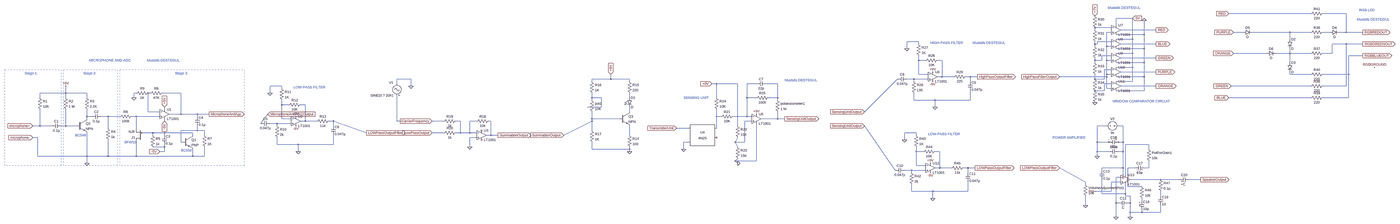
[diagram p0: schematic OVERALL CİRCUİT DİAGRAM.asc, whole sheet]
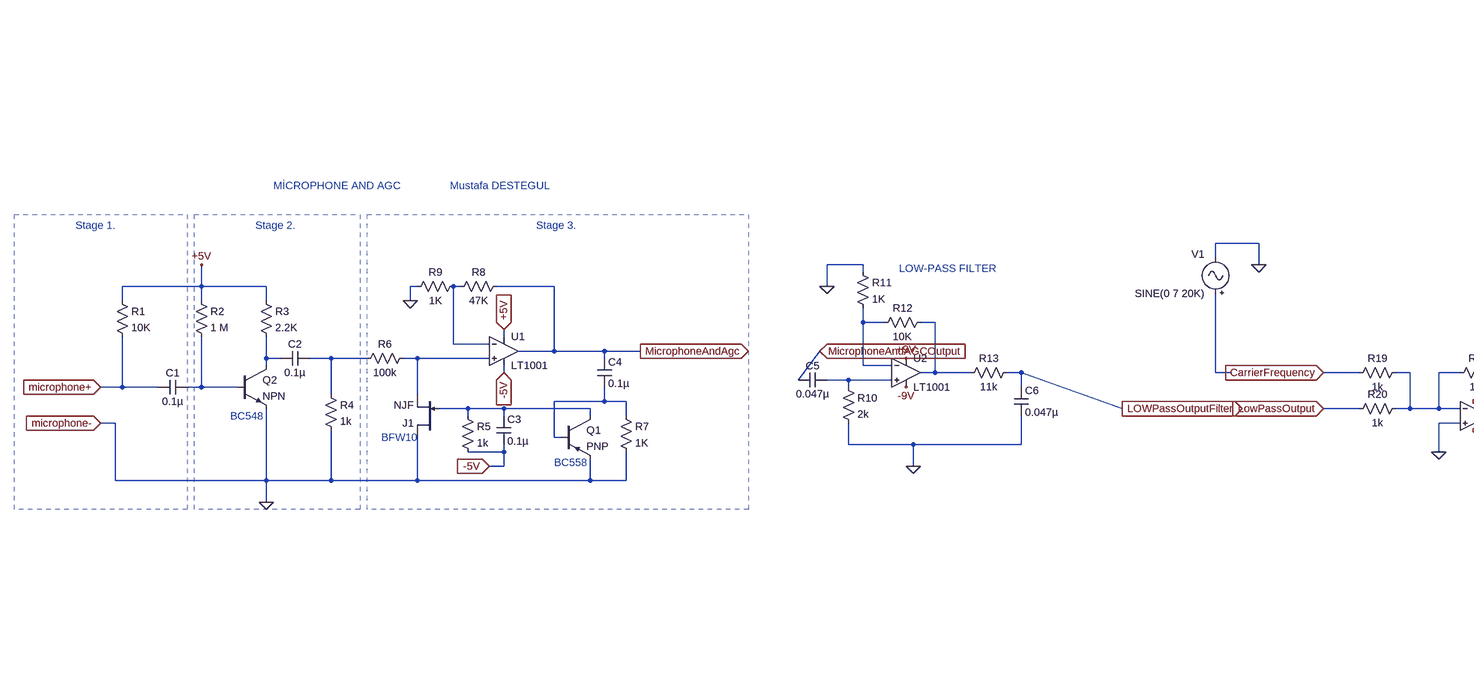
[diagram p1: schematic OVERALL CİRCUİT DİAGRAM.asc, part, row 1 of 1, column 1 of 3]
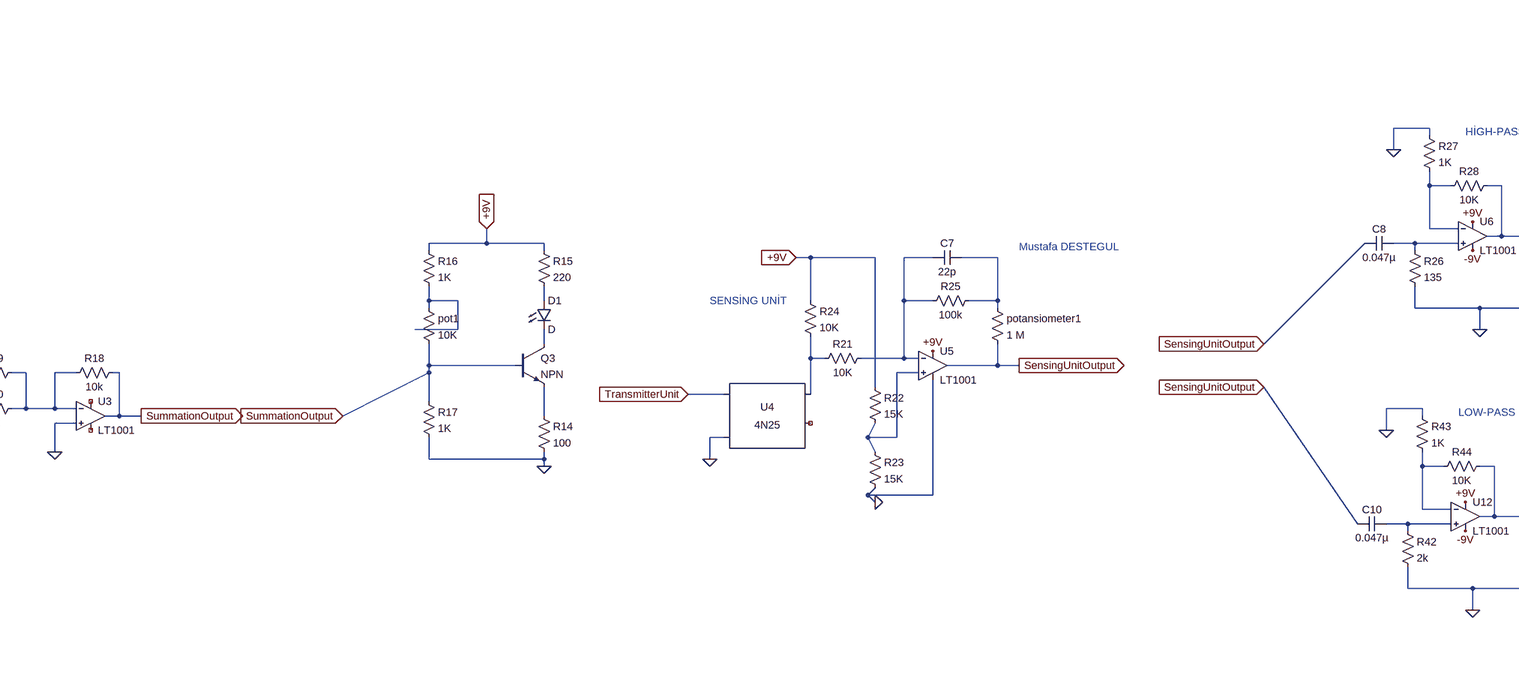
[diagram p2: schematic OVERALL CİRCUİT DİAGRAM.asc, part, row 1 of 1, column 2 of 3]
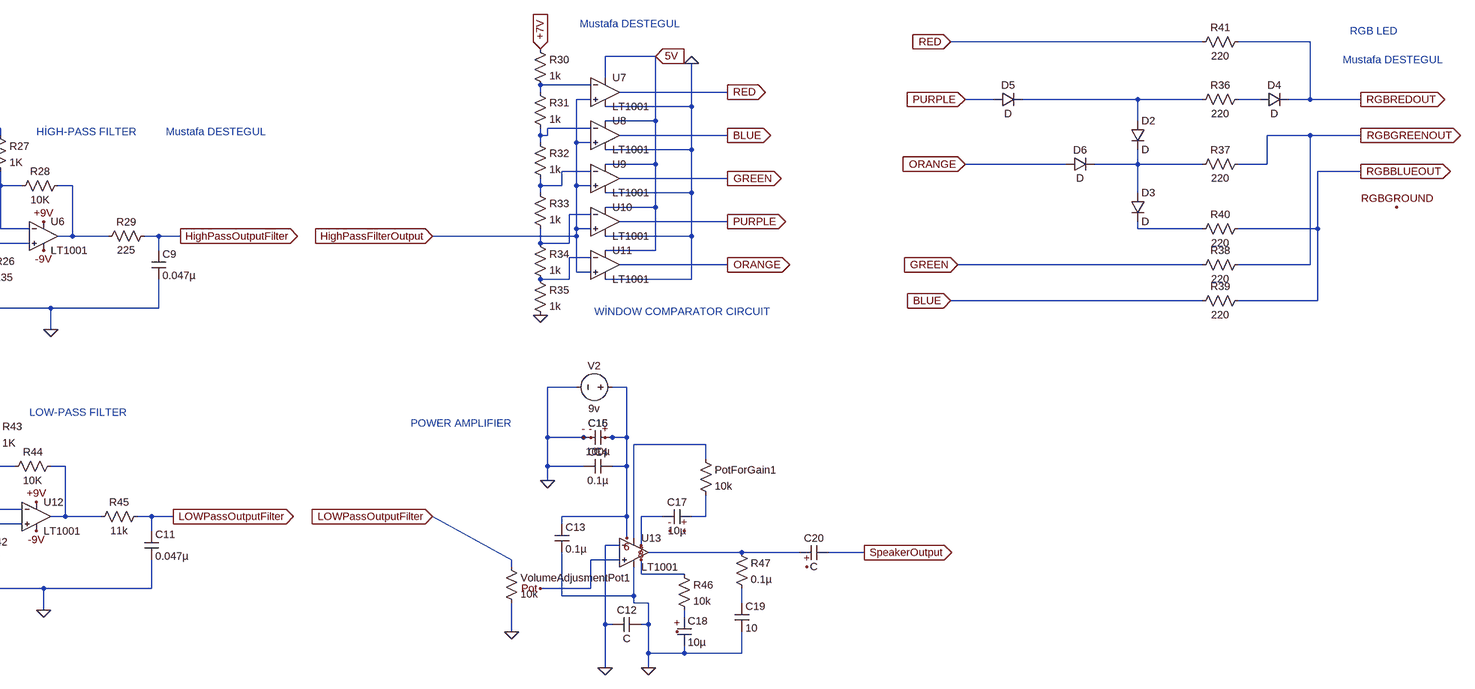
[diagram p3: schematic OVERALL CİRCUİT DİAGRAM.asc, part, row 1 of 1, column 3 of 3]
OVERALL CİRCUİT DİAGRAM.asc, the LTspice schematic file:
Version 4
SHEET 1 9064 680
WIRE 8464 -784 7888 -784
WIRE 8704 -784 8544 -784
WIRE 7232 -752 7120 -752
WIRE 7120 -704 7120 -752
WIRE 7088 -688 6976 -688
WIRE 6976 -672 6976 -688
WIRE 7392 -672 7152 -672
WIRE 7088 -656 7056 -656
WIRE 7984 -656 7920 -656
WIRE 8304 -656 8048 -656
WIRE 8464 -656 8304 -656
WIRE 8592 -656 8544 -656
WIRE 8704 -656 8704 -784
WIRE 8704 -656 8656 -656
WIRE 8816 -656 8704 -656
WIRE 7312 -640 7312 -736
WIRE 7312 -640 7120 -640
WIRE 7232 -608 7232 -752
WIRE 7232 -608 7120 -608
WIRE 8304 -608 8304 -656
WIRE 5776 -592 5696 -592
WIRE 7088 -592 6992 -592
WIRE 5776 -576 5776 -592
WIRE 6976 -576 6976 -592
WIRE 6992 -576 6992 -592
WIRE 6992 -576 6976 -576
WIRE 7392 -576 7152 -576
WIRE 8704 -576 8608 -576
WIRE 8816 -576 8704 -576
WIRE 6976 -560 6976 -576
WIRE 7056 -560 7056 -656
WIRE 7088 -560 7056 -560
WIRE 5696 -544 5696 -592
WIRE 7312 -544 7312 -640
WIRE 7312 -544 7120 -544
WIRE 7232 -512 7232 -608
WIRE 7232 -512 7120 -512
WIRE 8144 -512 7920 -512
WIRE 8304 -512 8304 -544
WIRE 8304 -512 8208 -512
WIRE 8464 -512 8304 -512
WIRE 8608 -512 8608 -576
WIRE 8608 -512 8544 -512
WIRE 7088 -496 7024 -496
WIRE 8816 -496 8720 -496
WIRE 7392 -480 7152 -480
WIRE 5776 -464 5776 -496
WIRE 5824 -464 5776 -464
WIRE 5936 -464 5904 -464
WIRE 6976 -464 6976 -480
WIRE 7024 -464 7024 -496
WIRE 7024 -464 6976 -464
WIRE 7056 -464 7056 -560
WIRE 7088 -464 7056 -464
WIRE 6976 -448 6976 -464
WIRE 7312 -448 7312 -544
WIRE 7312 -448 7120 -448
WIRE 8304 -448 8304 -512
WIRE 7232 -416 7232 -512
WIRE 7232 -416 7120 -416
WIRE 7088 -400 7040 -400
WIRE 7392 -384 7152 -384
WIRE 5776 -368 5776 -464
WIRE 5840 -368 5776 -368
WIRE 7056 -368 7056 -464
WIRE 7088 -368 7056 -368
WIRE 8304 -368 8304 -384
WIRE 8464 -368 8304 -368
WIRE 8720 -368 8720 -496
WIRE 8720 -368 8544 -368
WIRE 5936 -352 5936 -464
WIRE 5936 -352 5904 -352
WIRE 6016 -352 5936 -352
WIRE 6128 -352 6096 -352
WIRE 6176 -352 6128 -352
WIRE 7056 -352 7056 -368
WIRE 7056 -352 6736 -352
WIRE 7312 -352 7312 -448
WIRE 7312 -352 7120 -352
WIRE 2320 -336 2224 -336
WIRE 3680 -336 3680 -368
WIRE 3680 -336 3552 -336
WIRE 3808 -336 3680 -336
WIRE 5744 -336 5696 -336
WIRE 5840 -336 5744 -336
WIRE 6976 -336 6976 -368
WIRE 7040 -336 7040 -400
WIRE 7040 -336 6976 -336
WIRE 3552 -320 3552 -336
WIRE 3808 -320 3808 -336
WIRE 5744 -320 5744 -336
WIRE 6128 -320 6128 -352
WIRE 7232 -320 7232 -416
WIRE 7232 -320 7120 -320
WIRE 2224 -304 2224 -336
WIRE 4400 -304 4368 -304
WIRE 4544 -304 4400 -304
WIRE 4672 -304 4608 -304
WIRE 4816 -304 4736 -304
WIRE 7088 -304 7040 -304
WIRE 1440 -288 1360 -288
WIRE 2320 -288 2320 -336
WIRE 7392 -288 7152 -288
WIRE 8464 -288 7904 -288
WIRE 8704 -288 8704 -576
WIRE 8704 -288 8544 -288
WIRE 1440 -272 1440 -288
WIRE 7056 -272 7056 -352
WIRE 7088 -272 7056 -272
WIRE 7040 -256 7040 -304
WIRE 7040 -256 6976 -256
WIRE 7312 -256 7312 -352
WIRE 7312 -256 7120 -256
WIRE -192 -240 -192 -288
WIRE -192 -240 -368 -240
WIRE -48 -240 -192 -240
WIRE 288 -240 272 -240
WIRE 384 -240 368 -240
WIRE 592 -240 464 -240
WIRE 1360 -240 1360 -288
WIRE -368 -208 -368 -240
WIRE -192 -208 -192 -240
WIRE -48 -208 -48 -240
WIRE 272 -208 272 -240
WIRE 3552 -208 3552 -240
WIRE 3616 -208 3552 -208
WIRE 3808 -208 3808 -240
WIRE 4400 -208 4400 -304
WIRE 4608 -208 4608 -304
WIRE 4672 -208 4608 -208
WIRE 4816 -208 4816 -304
WIRE 4816 -208 4752 -208
WIRE 8464 -208 7888 -208
WIRE 8720 -208 8720 -368
WIRE 8720 -208 8544 -208
WIRE 3552 -192 3552 -208
WIRE 4816 -192 4816 -208
WIRE 5744 -192 5744 -240
WIRE 5888 -192 5744 -192
WIRE 6128 -192 6128 -256
WIRE 6128 -192 5888 -192
WIRE 1440 -160 1440 -192
WIRE 1488 -160 1440 -160
WIRE 1600 -160 1568 -160
WIRE 3616 -144 3616 -208
WIRE 3616 -144 3520 -144
WIRE 5888 -144 5888 -192
WIRE 480 -128 480 -144
WIRE 368 -112 368 -240
WIRE 448 -112 368 -112
WIRE 3808 -112 3808 -144
WIRE 5408 -112 5632 -336
WIRE 592 -96 592 -240
WIRE 592 -96 512 -96
WIRE 704 -96 592 -96
WIRE 784 -96 704 -96
WIRE -48 -80 -48 -128
WIRE -16 -80 -48 -80
WIRE 96 -80 48 -80
WIRE 176 -80 96 -80
WIRE 288 -80 256 -80
WIRE 448 -80 288 -80
WIRE 704 -80 704 -96
WIRE 4400 -80 4400 -128
WIRE 4432 -80 4400 -80
WIRE 4608 -80 4608 -208
WIRE 4608 -80 4512 -80
WIRE 4640 -80 4608 -80
WIRE -48 -64 -48 -80
WIRE 1440 -64 1440 -160
WIRE 1504 -64 1440 -64
WIRE 3552 -64 3552 -112
WIRE 3744 -64 3552 -64
WIRE 4816 -64 4816 -112
WIRE 4816 -64 4704 -64
WIRE 4864 -64 4816 -64
WIRE 480 -48 480 -64
WIRE 1600 -48 1600 -160
WIRE 1600 -48 1568 -48
WIRE 1680 -48 1600 -48
WIRE 1792 -48 1760 -48
WIRE 2224 -48 2224 -224
WIRE 2256 -48 2224 -48
WIRE 2544 -48 2464 -48
WIRE 2656 -48 2624 -48
WIRE 2768 -48 2720 -48
WIRE 2864 -48 2848 -48
WIRE 3552 -48 3552 -64
WIRE 4640 -48 4592 -48
WIRE 1296 -32 1344 -96
WIRE 1408 -32 1360 -32
WIRE 1504 -32 1408 -32
WIRE -368 -16 -368 -128
WIRE -368 -16 -416 -16
WIRE -288 -16 -368 -16
WIRE -192 -16 -192 -128
WIRE -192 -16 -224 -16
WIRE -112 -16 -192 -16
WIRE 1408 -16 1408 -32
WIRE 1792 -16 1792 -48
WIRE 4544 -16 4544 -304
WIRE 7056 -16 6992 -16
WIRE 7168 -16 7136 -16
WIRE 96 0 96 -80
WIRE 288 0 288 -80
WIRE 4208 0 4128 0
WIRE 4400 0 4400 -80
WIRE 704 16 704 -16
WIRE 704 16 592 16
WIRE 752 16 704 16
WIRE 3552 16 3552 -48
WIRE 400 32 336 32
WIRE 480 32 400 32
WIRE 672 32 480 32
WIRE 2016 32 1792 -48
WIRE 2544 32 2464 32
WIRE 2656 32 2656 -48
WIRE 2656 32 2624 32
WIRE 2720 32 2720 -48
WIRE 2720 32 2656 32
WIRE 2768 32 2720 32
WIRE 5760 32 5680 32
WIRE 400 48 400 32
WIRE 480 48 480 32
WIRE 672 48 672 32
WIRE 752 48 752 16
WIRE 2864 48 2864 -48
WIRE 2864 48 2832 48
WIRE 2912 48 2864 48
WIRE 3360 48 3552 -48
WIRE 3808 48 3808 -16
WIRE 5760 48 5760 32
WIRE -384 64 -416 64
WIRE 2768 64 2720 64
WIRE 5680 80 5680 32
WIRE 592 96 592 16
WIRE 608 96 592 96
WIRE 4208 96 4176 96
WIRE 4528 96 4544 64
WIRE 4592 96 4592 -48
WIRE 4592 96 4528 96
WIRE 6992 96 6992 -16
WIRE 7072 96 6992 96
WIRE 7168 96 7168 -16
WIRE 7168 96 7136 96
WIRE 1408 112 1408 64
WIRE 1552 112 1408 112
WIRE 1792 112 1792 48
WIRE 1792 112 1552 112
WIRE 7344 112 7184 112
WIRE 480 128 480 112
WIRE 480 128 400 128
WIRE 2720 128 2720 64
WIRE 4544 128 4528 96
WIRE 3552 144 3552 96
WIRE 3808 144 3808 128
WIRE 3808 144 3552 144
WIRE 4176 144 4176 96
WIRE 7344 144 7344 112
WIRE 480 160 480 128
WIRE 480 160 448 160
WIRE 1552 160 1552 112
WIRE 3808 160 3808 144
WIRE 5760 160 5760 128
WIRE 5808 160 5760 160
WIRE 5920 160 5888 160
WIRE 6992 160 6992 96
WIRE 7072 160 6992 160
WIRE 7168 160 7168 96
WIRE 7168 160 7136 160
WIRE -384 192 -384 64
WIRE -48 192 -48 32
WIRE -48 192 -384 192
WIRE 96 192 96 80
WIRE 96 192 -48 192
WIRE 288 192 288 96
WIRE 288 192 96 192
WIRE 672 192 672 144
WIRE 672 192 288 192
WIRE 752 192 752 128
WIRE 752 192 672 192
WIRE 6992 192 6992 160
WIRE 4528 224 4544 208
WIRE 4672 224 4672 -32
WIRE 4672 224 4528 224
WIRE -48 240 -48 192
WIRE 4544 240 4528 224
WIRE 5760 256 5760 160
WIRE 5824 256 5760 256
WIRE 5920 272 5920 160
WIRE 5920 272 5888 272
WIRE 6000 272 5920 272
WIRE 6112 272 6080 272
WIRE 6160 272 6112 272
WIRE 7168 272 7168 160
WIRE 7168 272 7024 272
WIRE 7248 272 7200 272
WIRE 7344 272 7344 224
WIRE 7344 272 7312 272
WIRE 5616 288 5408 -16
WIRE 5728 288 5680 288
WIRE 5824 288 5728 288
WIRE 7024 288 7024 272
WIRE 5728 304 5728 288
WIRE 6112 304 6112 272
WIRE 7168 320 7168 272
WIRE 7184 320 7184 112
WIRE 7152 336 7120 336
WIRE 7200 336 7200 272
WIRE 7424 352 7216 352
WIRE 7552 352 7424 352
WIRE 7696 352 7616 352
WIRE 6912 368 6736 272
WIRE 7152 368 7088 368
WIRE 6912 384 6912 368
WIRE 7200 400 7200 368
WIRE 7296 400 7200 400
WIRE 5728 432 5728 384
WIRE 5872 432 5728 432
WIRE 6112 432 6112 368
WIRE 6112 432 5872 432
WIRE 7088 432 7088 368
WIRE 7088 432 6976 432
WIRE 7024 448 7024 352
WIRE 7184 448 7184 384
WIRE 7184 448 7024 448
WIRE 7184 464 7184 448
WIRE 7216 464 7184 464
WIRE 7424 464 7424 432
WIRE 5872 480 5872 432
WIRE 7296 496 7296 480
WIRE 7120 512 7120 336
WIRE 7136 512 7120 512
WIRE 7216 512 7216 464
WIRE 7216 512 7200 512
WIRE 6912 528 6912 464
WIRE 7216 576 7216 512
WIRE 7296 576 7296 560
WIRE 7296 576 7216 576
WIRE 7424 576 7424 528
WIRE 7424 576 7296 576
WIRE 7120 608 7120 512
WIRE 7216 608 7216 576
FLAG -416 -16 microphone+
IOPIN -416 -16 In
FLAG -48 240 0
FLAG 448 160 -5V
IOPIN 448 160 In
FLAG 272 -208 0
FLAG 480 -48 -5V
IOPIN 480 -48 In
FLAG 480 -144 +5V
IOPIN 480 -144 In
FLAG 784 -96 MicrophoneAndAgc
IOPIN 784 -96 Out
FLAG -416 64 microphone-
IOPIN -416 64 In
FLAG -192 -288 +5V
FLAG 1552 160 0
FLAG 1360 -240 0
FLAG 1536 -80 +9V
FLAG 1536 -16 -9V
FLAG 1344 -96 MicrophoneAndAGCOutput
IOPIN 1344 -96 In
FLAG 2016 32 LOWPassOutputFilter
IOPIN 2016 32 Out
FLAG 3360 48 SummationOutput
IOPIN 3360 48 In
FLAG 3808 160 0
FLAG 3680 -368 +9V
IOPIN 3680 -368 In
FLAG 2720 128 0
FLAG 2464 -48 CarrierFrequency
IOPIN 2464 -48 In
FLAG 2464 32 LowPassOutput
IOPIN 2464 32 In
FLAG 2912 48 SummationOutput
IOPIN 2912 48 Out
FLAG 2320 -288 0
FLAG 4128 0 TransmitterUnit
IOPIN 4128 0 In
FLAG 4176 144 0
FLAG 4544 240 0
FLAG 4368 -304 +9V
IOPIN 4368 -304 In
FLAG 4672 -96 +9V
FLAG 4864 -64 SensingUnitOutput
IOPIN 4864 -64 Out
FLAG 5888 -144 0
FLAG 5696 -544 0
FLAG 5872 -384 +9V
FLAG 5872 -320 -9V
FLAG 5408 -112 SensingUnitOutput
IOPIN 5408 -112 In
FLAG 6176 -352 HighPassOutputFilter
IOPIN 6176 -352 Out
FLAG 6736 -352 HighPassFilterOutput
IOPIN 6736 -352 In
FLAG 6976 -768 +7V
IOPIN 6976 -768 In
FLAG 6976 -176 0
FLAG 7312 -736 0
IOPIN 7312 -736 In
FLAG 7232 -752 5V
IOPIN 7232 -752 In
FLAG 7392 -672 RED
IOPIN 7392 -672 Out
FLAG 7392 -480 GREEN
IOPIN 7392 -480 Out
FLAG 7392 -576 BLUE
IOPIN 7392 -576 Out
FLAG 7392 -288 ORANGE
IOPIN 7392 -288 Out
FLAG 7392 -384 PURPLE
IOPIN 7392 -384 Out
FLAG 7888 -784 RED
IOPIN 7888 -784 In
FLAG 7904 -288 GREEN
IOPIN 7904 -288 In
FLAG 7888 -208 BLUE
IOPIN 7888 -208 In
FLAG 7920 -656 PURPLE
IOPIN 7920 -656 In
FLAG 7920 -512 ORANGE
IOPIN 7920 -512 In
FLAG 8816 -656 RGBREDOUT
IOPIN 8816 -656 Out
FLAG 8816 -576 RGBGREENOUT
IOPIN 8816 -576 Out
FLAG 8816 -496 RGBBLUEOUT
IOPIN 8816 -496 Out
FLAG 8896 -416 RGBGROUND
FLAG 5872 480 0
FLAG 5680 80 0
FLAG 5856 240 +9V
FLAG 5856 304 -9V
FLAG 5408 -16 SensingUnitOutput
IOPIN 5408 -16 In
FLAG 6160 272 LOWPassOutputFilter
IOPIN 6160 272 Out
FLAG 6736 272 LOWPassOutputFilter
IOPIN 6736 272 In
FLAG 6976 432 Pot
FLAG 6912 528 0
FLAG 7168 320 6
FLAG 7200 336 8
FLAG 7200 368 7
FLAG 7120 608 0
FLAG 7216 608 0
FLAG 6992 192 0
FLAG 7120 96 +
FLAG 7072 96 -
FLAG 7088 96 -
FLAG 7296 304 +
FLAG 7264 304 -
FLAG 7280 528 +
FLAG 7696 352 SpeakerOutput
IOPIN 7696 352 Out
FLAG 7568 384 +
SYMBOL res -384 -224 R0
SYMATTR InstName R1
SYMATTR Value 10K
SYMBOL cap -224 -32 R90
WINDOW 0 0 32 VBottom 2
WINDOW 3 32 32 VTop 2
SYMATTR InstName C1
SYMATTR Value 0.1µ
SYMBOL res -208 -224 R0
SYMATTR InstName R2
SYMATTR Value 1 M
SYMBOL res -64 -224 R0
SYMATTR InstName R3
SYMATTR Value 2.2K
SYMBOL npn -112 -64 R0
SYMATTR InstName Q2
SYMBOL cap 48 -96 R90
WINDOW 0 0 32 VBottom 2
WINDOW 3 32 32 VTop 2
SYMATTR InstName C2
SYMATTR Value 0.1µ
SYMBOL res 80 -16 R0
SYMATTR InstName R4
SYMATTR Value 1k
SYMBOL res 272 -96 R90
WINDOW 0 0 56 VBottom 2
WINDOW 3 32 56 VTop 2
SYMATTR InstName R6
SYMATTR Value 100k
SYMBOL njf 336 96 R180
SYMATTR InstName J1
SYMBOL res 384 32 R0
SYMATTR InstName R5
SYMATTR Value 1k
SYMBOL cap 464 48 R0
SYMATTR InstName C3
SYMATTR Value 0.1µ
SYMBOL pnp 608 48 R0
SYMATTR InstName Q1
SYMBOL res 736 32 R0
SYMATTR InstName R7
SYMATTR Value 1K
SYMBOL cap 688 -80 R0
SYMATTR InstName C4
SYMATTR Value 0.1µ
SYMBOL Opamps\\LT1001 480 -160 R0
SYMATTR InstName U1
SYMBOL res 480 -256 R90
WINDOW 0 0 56 VBottom 2
WINDOW 3 32 56 VTop 2
SYMATTR InstName R8
SYMATTR Value 47K
SYMBOL res 384 -256 R90
WINDOW 0 0 56 VBottom 2
WINDOW 3 32 56 VTop 2
SYMATTR InstName R9
SYMATTR Value 1K
SYMBOL cap 1360 -48 R90
WINDOW 0 0 32 VBottom 2
WINDOW 3 32 32 VTop 2
SYMATTR InstName C5
SYMATTR Value 0.047µ
SYMBOL res 1392 -32 R0
SYMATTR InstName R10
SYMATTR Value 2k
SYMBOL Opamps\\LT1001 1536 -112 R0
SYMATTR InstName U2
SYMBOL res 1424 -288 R0
SYMATTR InstName R11
SYMATTR Value 1K
SYMBOL res 1584 -176 R90
WINDOW 0 0 56 VBottom 2
WINDOW 3 32 56 VTop 2
SYMATTR InstName R12
SYMATTR Value 10K
SYMBOL res 1776 -64 R90
WINDOW 0 0 56 VBottom 2
WINDOW 3 32 56 VTop 2
SYMATTR InstName R13
SYMATTR Value 11k
SYMBOL cap 1776 -16 R0
SYMATTR InstName C6
SYMATTR Value 0.047µ
SYMBOL npn 3744 -112 R0
SYMATTR InstName Q3
SYMBOL res 3792 32 R0
SYMATTR InstName R14
SYMATTR Value 100
SYMBOL LED 3792 -208 R0
SYMATTR InstName D1
SYMBOL res 3792 -336 R0
SYMATTR InstName R15
SYMATTR Value 220
SYMBOL res 3536 -336 R0
SYMATTR InstName R16
SYMATTR Value 1K
SYMBOL res 3536 -208 R0
SYMATTR InstName pot1
SYMATTR Value 10K
SYMBOL res 3536 0 R0
SYMATTR InstName R17
SYMATTR Value 1K
SYMBOL Opamps\\LT1001 2800 -16 R0
SYMATTR InstName U3
SYMBOL res 2864 -64 R90
WINDOW 0 0 56 VBottom 2
WINDOW 3 32 56 VTop 2
SYMATTR InstName R18
SYMATTR Value 10k
SYMBOL res 2640 -64 R90
WINDOW 0 0 56 VBottom 2
WINDOW 3 32 56 VTop 2
SYMATTR InstName R19
SYMATTR Value 1k
SYMBOL res 2640 16 R90
WINDOW 0 0 56 VBottom 2
WINDOW 3 32 56 VTop 2
SYMATTR InstName R20
SYMATTR Value 1k
SYMBOL Misc\\signal 2224 -208 R180
WINDOW 0 24 104 Left 2
WINDOW 3 24 16 Left 2
WINDOW 123 0 0 Left 0
WINDOW 39 0 0 Left 0
SYMATTR InstName V1
SYMATTR Value SINE(0 7 20K)
SYMBOL Optos\\4N25 4304 64 R0
SYMATTR InstName U4
SYMBOL Opamps\\LT1001 4672 -128 R0
SYMATTR InstName U5
SYMBOL res 4528 -96 R90
WINDOW 0 0 56 VBottom 2
WINDOW 3 32 56 VTop 2
SYMATTR InstName R21
SYMATTR Value 10K
SYMBOL res 4528 -32 R0
SYMATTR InstName R22
SYMATTR Value 15K
SYMBOL res 4528 112 R0
SYMATTR InstName R23
SYMATTR Value 15K
SYMBOL res 4384 -224 R0
SYMATTR InstName R24
SYMATTR Value 10K
SYMBOL res 4768 -224 R90
WINDOW 0 0 56 VBottom 2
WINDOW 3 32 56 VTop 2
SYMATTR InstName R25
SYMATTR Value 100k
SYMBOL res 4800 -208 R0
SYMATTR InstName potansiometer1
SYMATTR Value 1 M
SYMBOL cap 4736 -320 R90
WINDOW 0 0 32 VBottom 2
WINDOW 3 32 32 VTop 2
SYMATTR InstName C7
SYMATTR Value 22p
SYMBOL cap 5696 -352 R90
WINDOW 0 0 32 VBottom 2
WINDOW 3 32 32 VTop 2
SYMATTR InstName C8
SYMATTR Value 0.047µ
SYMBOL res 5728 -336 R0
SYMATTR InstName R26
SYMATTR Value 135
SYMBOL Opamps\\LT1001 5872 -416 R0
SYMATTR InstName U6
SYMBOL res 5760 -592 R0
SYMATTR InstName R27
SYMATTR Value 1K
SYMBOL res 5920 -480 R90
WINDOW 0 0 56 VBottom 2
WINDOW 3 32 56 VTop 2
SYMATTR InstName R28
SYMATTR Value 10K
SYMBOL res 6112 -368 R90
WINDOW 0 0 56 VBottom 2
WINDOW 3 32 56 VTop 2
SYMATTR InstName R29
SYMATTR Value 225
SYMBOL cap 6112 -320 R0
SYMATTR InstName C9
SYMATTR Value 0.047µ
SYMBOL Opamps\\LT1001 7120 -736 R0
SYMATTR InstName U7
SYMBOL Opamps\\LT1001 7120 -640 R0
SYMATTR InstName U8
SYMBOL Opamps\\LT1001 7120 -544 R0
SYMATTR InstName U9
SYMBOL Opamps\\LT1001 7120 -448 R0
SYMATTR InstName U10
SYMBOL Opamps\\LT1001 7120 -352 R0
SYMATTR InstName U11
SYMBOL res 6960 -784 R0
SYMATTR InstName R30
SYMATTR Value 1k
SYMBOL res 6960 -688 R0
SYMATTR InstName R31
SYMATTR Value 1k
SYMBOL res 6960 -576 R0
SYMATTR InstName R32
SYMATTR Value 1k
SYMBOL res 6960 -464 R0
SYMATTR InstName R33
SYMATTR Value 1k
SYMBOL res 6960 -352 R0
SYMATTR InstName R34
SYMATTR Value 1k
SYMBOL res 6960 -272 R0
SYMATTR InstName R35
SYMATTR Value 1k
SYMBOL diode 8288 -608 R0
SYMATTR InstName D2
SYMBOL diode 8288 -448 R0
SYMATTR InstName D3
SYMBOL res 8560 -672 R90
WINDOW 0 0 56 VBottom 2
WINDOW 3 32 56 VTop 2
SYMATTR InstName R36
SYMATTR Value 220
SYMBOL res 8560 -528 R90
WINDOW 0 0 56 VBottom 2
WINDOW 3 32 56 VTop 2
SYMATTR InstName R37
SYMATTR Value 220
SYMBOL res 8560 -304 R90
WINDOW 0 0 56 VBottom 2
WINDOW 3 32 56 VTop 2
SYMATTR InstName R38
SYMATTR Value 220
SYMBOL res 8560 -224 R90
WINDOW 0 0 56 VBottom 2
WINDOW 3 32 56 VTop 2
SYMATTR InstName R39
SYMATTR Value 220
SYMBOL diode 8592 -640 R270
WINDOW 0 32 32 VTop 2
WINDOW 3 0 32 VBottom 2
SYMATTR InstName D4
SYMBOL diode 7984 -640 R270
WINDOW 0 32 32 VTop 2
WINDOW 3 0 32 VBottom 2
SYMATTR InstName D5
SYMBOL diode 8144 -496 R270
WINDOW 0 32 32 VTop 2
WINDOW 3 0 32 VBottom 2
SYMATTR InstName D6
SYMBOL res 8560 -384 R90
WINDOW 0 0 56 VBottom 2
WINDOW 3 32 56 VTop 2
SYMATTR InstName R40
SYMATTR Value 220
SYMBOL res 8560 -800 R90
WINDOW 0 0 56 VBottom 2
WINDOW 3 32 56 VTop 2
SYMATTR InstName R41
SYMATTR Value 220
SYMBOL cap 5680 272 R90
WINDOW 0 0 32 VBottom 2
WINDOW 3 32 32 VTop 2
SYMATTR InstName C10
SYMATTR Value 0.047µ
SYMBOL res 5712 288 R0
SYMATTR InstName R42
SYMATTR Value 2k
SYMBOL Opamps\\LT1001 5856 208 R0
SYMATTR InstName U12
SYMBOL res 5744 32 R0
SYMATTR InstName R43
SYMATTR Value 1K
SYMBOL res 5904 144 R90
WINDOW 0 0 56 VBottom 2
WINDOW 3 32 56 VTop 2
SYMATTR InstName R44
SYMATTR Value 10K
SYMBOL res 6096 256 R90
WINDOW 0 0 56 VBottom 2
WINDOW 3 32 56 VTop 2
SYMATTR InstName R45
SYMATTR Value 11k
SYMBOL cap 6096 304 R0
SYMATTR InstName C11
SYMATTR Value 0.047µ
SYMBOL res 6896 368 R0
SYMATTR InstName VolumeAdjusmentPot1
SYMATTR Value 10k
SYMBOL Opamps\\LT1001 7184 288 R0
SYMATTR InstName U13
SYMBOL cap 7200 496 R90
WINDOW 0 0 32 VBottom 2
WINDOW 3 32 32 VTop 2
SYMATTR InstName C12
SYMBOL cap 7008 288 R0
SYMATTR InstName C13
SYMATTR Value 0.1µ
SYMBOL cap 7136 144 R90
WINDOW 0 0 32 VBottom 2
WINDOW 3 32 32 VTop 2
SYMATTR InstName C14
SYMATTR Value 0.1µ
SYMBOL cap 7136 80 R90
WINDOW 0 0 32 VBottom 2
WINDOW 3 32 32 VTop 2
SYMATTR InstName C15
SYMATTR Value 100µ
SYMBOL cap 7136 80 R90
WINDOW 0 0 32 VBottom 2
WINDOW 3 32 32 VTop 2
SYMATTR InstName C16
SYMBOL voltage 7152 -16 R90
WINDOW 0 -32 56 VBottom 2
WINDOW 3 32 56 VTop 2
WINDOW 123 0 0 Left 0
WINDOW 39 0 0 Left 0
SYMATTR InstName V2
SYMATTR Value 9v
SYMBOL cap 7312 256 R90
WINDOW 0 0 32 VBottom 2
WINDOW 3 32 32 VTop 2
SYMATTR InstName C17
SYMATTR Value 10µ
SYMBOL res 7328 128 R0
SYMATTR InstName PotForGain1
SYMATTR Value 10k
SYMBOL res 7280 384 R0
SYMATTR InstName R46
SYMATTR Value 10k
SYMBOL cap 7280 496 R0
SYMATTR InstName C18
SYMATTR Value 10µ
SYMBOL res 7408 336 R0
SYMATTR InstName R47
SYMATTR Value 0.1µ
SYMBOL cap 7408 464 R0
SYMATTR InstName C19
SYMATTR Value 10
SYMBOL cap 7616 336 R90
WINDOW 0 0 32 VBottom 2
WINDOW 3 32 32 VTop 2
SYMATTR InstName C20
TEXT -32 -464 Left 2 ;MİCROPHONE AND AGC
TEXT -128 48 Left 2 ;BC548
TEXT 208 96 Left 2 ;BFW10
TEXT 592 152 Left 2 ;BC558
TEXT 360 -464 Left 2 ;Mustafa DESTEGUL
TEXT -472 -376 Left 2 ;Stage 1.
TEXT -72 -376 Left 2 ;Stage 2.
TEXT 552 -376 Left 2 ;Stage 3.
TEXT 1520 -280 Left 2 ;LOW-PASS FILTER
TEXT 4176 -208 Left 2 ;SENSİNG UNİT
TEXT 4864 -328 Left 2 ;Mustafa DESTEGUL
TEXT 5856 -584 Left 2 ;HİGH-PASS FILTER
TEXT 6144 -584 Left 2 ;Mustafa DESTEGUL
TEXT 7096 -184 Left 2 ;WİNDOW COMPARATOR CIRCUIT
TEXT 7064 -824 Left 2 ;Mustafa DESTEGUL
TEXT 8792 -808 Left 2 ;RGB LED
TEXT 8776 -744 Left 2 ;Mustafa DESTEGUL
TEXT 5840 40 Left 2 ;LOW-PASS FILTER
TEXT 6688 64 Left 2 ;POWER AMPLIFIER
RECTANGLE Normal -224 256 -608 -400 2
RECTANGLE Normal 160 256 -208 -400 2
RECTANGLE Normal 1024 256 176 -400 2

The netlist it stands for:
* OVERALL CİRCUİT DİAGRAM.asc
R1 +5V microphone+ 10K
C1 N029 microphone+ 0.1µ
R2 +5V N029 1 M
R3 +5V N021 2.2K
Q2 N021 N029 0 0 NPN
C2 N022 N021 0.1µ
R4 N022 0 1k
R6 N023 N022 100k
J1 0 N031 N023 NJF
R5 N031 -5V 1k
C3 N031 -5V 0.1µ
Q1 N031 N030 0 0 PNP
R7 N030 0 1K
C4 MicrophoneAndAgc N030 0.1µ
XU1 N023 N015 +5V -5V MicrophoneAndAgc LT1001  ; pins In+ In- V+ V- OUT
R8 MicrophoneAndAgc N015 47K
R9 N015 0 1K
C5 N028 MicrophoneAndAGCOutput 0.047µ
R10 N028 0 2k
XU2 N028 N018 +9V -9V N019 LT1001  ; pins In+ In- V+ V- OUT
R11 0 N018 1K
R12 N019 N018 10K
R13 LOWPassOutputFilter N019 11k
C6 LOWPassOutputFilter 0 0.047µ
Q3 N020 SummationOutput N032 0 NPN
R14 N032 0 100
D1 N017 N020 D
R15 +9V N017 220
R16 +9V N016 1K
R§pot1 N016 SummationOutput 10K
R17 SummationOutput 0 1K
XU3 0 N026 NC_01 NC_02 SummationOutput LT1001  ; pins In+ In- V+ V- OUT
R18 SummationOutput N026 10k
R19 N026 CarrierFrequency 1k
R20 N026 LowPassOutput 1k
V1 N025 0 SINE(0 7 20K)
XU4 TransmitterUnit 0 N024 NC_03 NC_04 4N25
XU5 N027 N012 +9V 0 SensingUnitOutput LT1001  ; pins In+ In- V+ V- OUT
R21 N012 N024 10K
R22 +9V N027 15K
R23 N027 0 15K
R24 +9V N024 10K
R25 N013 N012 100k
R§potansiometer1 N013 SensingUnitOutput 1 M
C7 N013 N012 22p
C8 N011 SensingUnitOutput 0.047µ
R26 N011 0 135
XU6 N011 N007 +9V -9V N008 LT1001  ; pins In+ In- V+ V- OUT
R27 0 N007 1K
R28 N008 N007 10K
R29 HighPassOutputFilter N008 225
C9 HighPassOutputFilter 0 0.047µ
XU7 HighPassFilterOutput N001 5V 0 RED LT1001  ; pins In+ In- V+ V- OUT
XU8 HighPassFilterOutput N004 5V 0 BLUE LT1001  ; pins In+ In- V+ V- OUT
XU9 HighPassFilterOutput N006 5V 0 GREEN LT1001  ; pins In+ In- V+ V- OUT
XU10 HighPassFilterOutput N009 5V 0 PURPLE LT1001  ; pins In+ In- V+ V- OUT
XU11 HighPassFilterOutput N014 5V 0 ORANGE LT1001  ; pins In+ In- V+ V- OUT
R30 +7V N001 1k
R31 N001 N004 1k
R32 N004 N006 1k
R33 N006 N009 1k
R34 N009 N014 1k
R35 N014 0 1k
D2 N002 N005 D
D3 N005 N010 D
R36 N003 N002 220
R37 RGBGREENOUT N005 220
R38 RGBGREENOUT GREEN 220
R39 RGBBLUEOUT BLUE 220
D4 N003 RGBREDOUT D
D5 PURPLE N002 D
D6 ORANGE N005 D
R40 RGBBLUEOUT N010 220
R41 RGBREDOUT RED 220
C10 N037 SensingUnitOutput 0.047µ
R42 N037 0 2k
XU12 N037 N034 +9V -9V N035 LT1001  ; pins In+ In- V+ V- OUT
R43 0 N034 1K
R44 N035 N034 10K
R45 LOWPassOutputFilter N035 11k
C11 LOWPassOutputFilter 0 0.047µ
R§VolumeAdjusmentPot1 LOWPassOutputFilter 0 10k
XU13 Pot 0 N033 0 N038 LT1001  ; pins In+ In- V+ V- OUT
C12 0 0 C
C13 6 0 0.1µ
C14 6 0 0.1µ
C15 6 0 100µ
C16 6 0 C
V2 6 0 9v
C17 N036 8 10µ
R§PotForGain1 N033 N036 10k
R46 7 N040 10k
C18 N040 0 10µ
R47 N038 N039 0.1µ
C19 N039 0 10
C20 SpeakerOutput N038 C
.model D D
.lib standard.dio
.model NPN NPN
.model PNP PNP
.lib standard.bjt
.model NJF NJF
.model PJF PJF
.lib standard.jft
* MİCROPHONE AND AGC
* BC548
* BFW10
* BC558
* Mustafa DESTEGUL
* Stage 1.
* Stage 2.
* Stage 3.
* LOW-PASS FILTER
* SENSİNG UNİT
* Mustafa DESTEGUL
* HİGH-PASS FILTER
* Mustafa DESTEGUL
* WİNDOW COMPARATOR CIRCUIT
* Mustafa DESTEGUL
* RGB LED
* Mustafa DESTEGUL
* LOW-PASS FILTER
* POWER AMPLIFIER
.lib LTC.lib
.lib 4N25.sub
.backanno
.end